# Altium schematic sheet S02.SchDoc: DQLA-Q  Dual QLA Interface Board
size 381 x 254 mm; Revision: 1.1; SheetNumber: 2; SheetTotal: 3
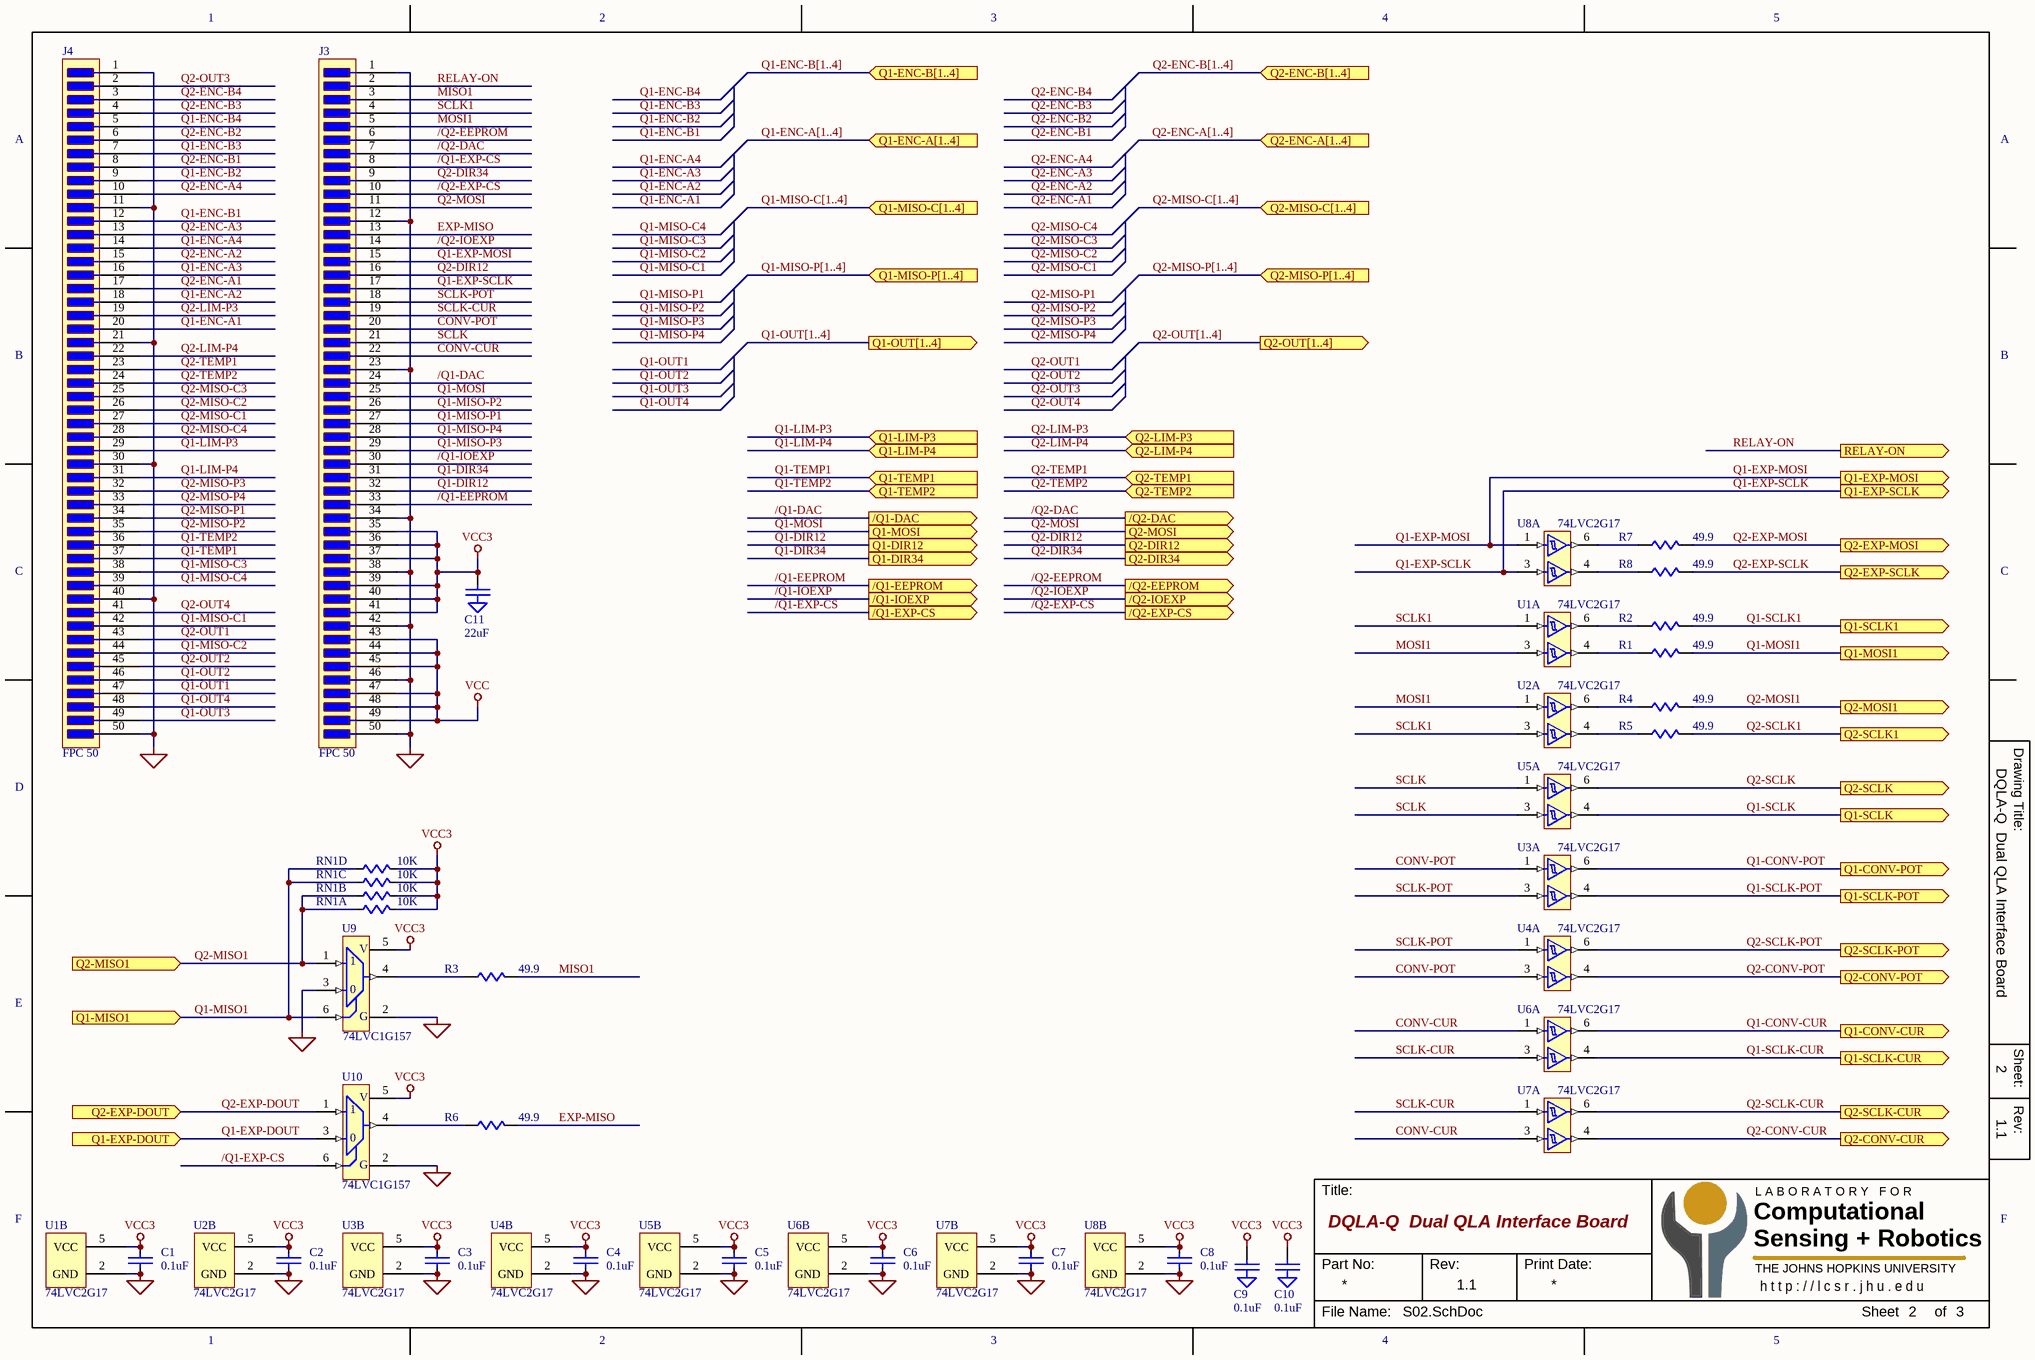
[diagram p0: S02.SchDoc]

## Parts
C1  0.1uF  [C0402]
C2  0.1uF  [C0402]
C3  0.1uF  [C0402]
C4  0.1uF  [C0402]
C5  0.1uF  [C0402]
C6  0.1uF  [C0402]
C7  0.1uF  [C0402]
C8  0.1uF  [C0402]
C9  0.1uF  [C0402]
C10  0.1uF  [C0402]
C11  22uF  [C0805]
J3  FPC 50  [CONN-XF3M1-5015-1B]
J4  FPC 50  [CONN-XF3M1-5015-1B]
R1  49.9  [R0402]
R2  49.9  [R0402]
R3  49.9  [R0402]
R4  49.9  [R0402]
R5  49.9  [R0402]
R6  49.9  [R0402]
R7  49.9  [R0402]
R8  49.9  [R0402]
RN1  10K  [RN-742C083]  (parts A,B,C,D of 4)
U1  74LVC2G17  [SC70-6]  (parts A,B of 2)
U2  74LVC2G17  [SC70-6]  (parts A,B of 2)
U3  74LVC2G17  [SC70-6]  (parts A,B of 2)
U4  74LVC2G17  [SC70-6]  (parts A,B of 2)
U5  74LVC2G17  [SC70-6]  (parts A,B of 2)
U6  74LVC2G17  [SC70-6]  (parts A,B of 2)
U7  74LVC2G17  [SC70-6]  (parts A,B of 2)
U8  74LVC2G17  [SC70-6]  (parts A,B of 2)
U9  74LVC1G157  [SC70-6]
U10  74LVC1G157  [SC70-6]

## Ports
/Q1-DAC (out), /Q1-EEPROM (out), /Q1-EXP-CS (out), /Q1-IOEXP (out), /Q2-DAC (out), /Q2-EEPROM (out), /Q2-EXP-CS (out), /Q2-IOEXP (out), Q1-CONV-CUR (out), Q1-CONV-POT (out), Q1-DIR12 (out), Q1-DIR34 (out), Q1-ENC-A[1..4] (in), Q1-ENC-B[1..4] (in), Q1-EXP-DOUT (in), Q1-EXP-MOSI (out), Q1-EXP-SCLK (out), Q1-LIM-P3 (in), Q1-LIM-P4 (in), Q1-MISO1 (in), Q1-MISO-C[1..4] (in), Q1-MISO-P[1..4] (in), Q1-MOSI1 (out), Q1-MOSI (out), Q1-OUT[1..4] (out), Q1-SCLK1 (out), Q1-SCLK (out), Q1-SCLK-CUR (out), Q1-SCLK-POT (out), Q1-TEMP1 (in), Q1-TEMP2 (in), Q2-CONV-CUR (out), Q2-CONV-POT (out), Q2-DIR12 (out), Q2-DIR34 (out), Q2-ENC-A[1..4] (in), Q2-ENC-B[1..4] (in), Q2-EXP-DOUT (in), Q2-EXP-MOSI (out), Q2-EXP-SCLK (out), Q2-LIM-P3 (in), Q2-LIM-P4 (in), Q2-MISO1 (in), Q2-MISO-C[1..4] (in), Q2-MISO-P[1..4] (in), Q2-MOSI1 (out), Q2-MOSI (out), Q2-OUT[1..4] (out), Q2-SCLK1 (out), Q2-SCLK (out), Q2-SCLK-CUR (out), Q2-SCLK-POT (out), Q2-TEMP1 (in), Q2-TEMP2 (in), RELAY-ON (out)

## Nets
GND: C1.2 C2.2 C3.2 C4.2 C5.2 C6.2 C7.2 C8.2 C9.2(GND) C10.2(GND) C11.2(GND) J3.1 J3.12 J3.23 J3.34 J3.38 J3.42 J3.46 J3.50 J4.1 J4.11 J4.21 J4.30 J4.40 J4.50 U1.2(GND) U2.2(GND) U3.2(GND) U4.2(GND) U5.2(GND) U6.2(GND) U7.2(GND) U8.2(GND) U9.2(-) U9.3 U10.2(-)
VCC: J3.43 J3.44 J3.45 J3.47 J3.48 J3.49
VCC3: C1.1 C2.1 C3.1 C4.1 C5.1 C6.1 C7.1 C8.1 C9.1 C10.1 C11.1 J3.35 J3.36 J3.37 J3.39 J3.40 J3.41 RN1.5 RN1.6 RN1.7 RN1.8 U1.5(VCC) U2.5(VCC) U3.5(VCC) U4.5(VCC) U5.5(VCC) U6.5(VCC) U7.5(VCC) U8.5(VCC) U9.5(+) U10.5(+)
/Q1-DAC: J3.24 ; port /Q1-DAC
/Q1-EEPROM: J3.33 ; port /Q1-EEPROM
/Q1-EXP-CS: J3.8 U10.6 ; port /Q1-EXP-CS
/Q1-IOEXP: J3.30 ; port /Q1-IOEXP
/Q2-DAC: J3.7 ; port /Q2-DAC
/Q2-EEPROM: J3.6 ; port /Q2-EEPROM
/Q2-EXP-CS: J3.10 ; port /Q2-EXP-CS
/Q2-IOEXP: J3.14 ; port /Q2-IOEXP
CONV-CUR: J3.22 U6.1 U7.3
CONV-POT: J3.20 U3.1 U4.3
EXP-MISO: J3.13 R6.2
MISO1: J3.3 R3.2
MOSI1: J3.5 U1.3 U2.1
Q1-CONV-CUR: U6.6 ; port Q1-CONV-CUR
Q1-CONV-POT: U3.6 ; port Q1-CONV-POT
Q1-DIR12: J3.32 ; port Q1-DIR12
Q1-DIR34: J3.31 ; port Q1-DIR34
Q1-ENC-A1: J4.20
Q1-ENC-A2: J4.18
Q1-ENC-A3: J4.16
Q1-ENC-A4: J4.14
Q1-ENC-B1: J4.12
Q1-ENC-B2: J4.9
Q1-ENC-B3: J4.7
Q1-ENC-B4: J4.5
Q1-EXP-DOUT: U10.3 ; port Q1-EXP-DOUT
Q1-EXP-MOSI: J3.15 U8.1 ; port Q1-EXP-MOSI
Q1-EXP-SCLK: J3.17 U8.3 ; port Q1-EXP-SCLK
Q1-LIM-P3: J4.29 ; port Q1-LIM-P3
Q1-LIM-P4: J4.31 ; port Q1-LIM-P4
Q1-MISO1: RN1.3 RN1.4 U9.6 ; port Q1-MISO1
Q1-MISO-C1: J4.42
Q1-MISO-C2: J4.44
Q1-MISO-C3: J4.38
Q1-MISO-C4: J4.39
Q1-MISO-P1: J3.27
Q1-MISO-P2: J3.26
Q1-MISO-P3: J3.29
Q1-MISO-P4: J3.28
Q1-MOSI: J3.25 ; port Q1-MOSI
Q1-MOSI1: R1.2 ; port Q1-MOSI1
Q1-OUT1: J4.47
Q1-OUT2: J4.46
Q1-OUT3: J4.49
Q1-OUT4: J4.48
Q1-SCLK: U5.4 ; port Q1-SCLK
Q1-SCLK1: R2.2 ; port Q1-SCLK1
Q1-SCLK-CUR: U6.4 ; port Q1-SCLK-CUR
Q1-SCLK-POT: U3.4 ; port Q1-SCLK-POT
Q1-TEMP1: J4.37 ; port Q1-TEMP1
Q1-TEMP2: J4.36 ; port Q1-TEMP2
Q2-CONV-CUR: U7.4 ; port Q2-CONV-CUR
Q2-CONV-POT: U4.4 ; port Q2-CONV-POT
Q2-DIR12: J3.16 ; port Q2-DIR12
Q2-DIR34: J3.9 ; port Q2-DIR34
Q2-ENC-A1: J4.17
Q2-ENC-A2: J4.15
Q2-ENC-A3: J4.13
Q2-ENC-A4: J4.10
Q2-ENC-B1: J4.8
Q2-ENC-B2: J4.6
Q2-ENC-B3: J4.4
Q2-ENC-B4: J4.3
Q2-EXP-DOUT: U10.1 ; port Q2-EXP-DOUT
Q2-EXP-MOSI: R7.2 ; port Q2-EXP-MOSI
Q2-EXP-SCLK: R8.2 ; port Q2-EXP-SCLK
Q2-LIM-P3: J4.19 ; port Q2-LIM-P3
Q2-LIM-P4: J4.22 ; port Q2-LIM-P4
Q2-MISO1: RN1.1 RN1.2 U9.1 ; port Q2-MISO1
Q2-MISO-C1: J4.27
Q2-MISO-C2: J4.26
Q2-MISO-C3: J4.25
Q2-MISO-C4: J4.28
Q2-MISO-P1: J4.34
Q2-MISO-P2: J4.35
Q2-MISO-P3: J4.32
Q2-MISO-P4: J4.33
Q2-MOSI: J3.11 ; port Q2-MOSI
Q2-MOSI1: R4.2 ; port Q2-MOSI1
Q2-OUT1: J4.43
Q2-OUT2: J4.45
Q2-OUT3: J4.2
Q2-OUT4: J4.41
Q2-SCLK: U5.6 ; port Q2-SCLK
Q2-SCLK1: R5.2 ; port Q2-SCLK1
Q2-SCLK-CUR: U7.6 ; port Q2-SCLK-CUR
Q2-SCLK-POT: U4.6 ; port Q2-SCLK-POT
Q2-TEMP1: J4.23 ; port Q2-TEMP1
Q2-TEMP2: J4.24 ; port Q2-TEMP2
RELAY-ON: J3.2 ; port RELAY-ON
SCLK: J3.21 U5.1 U5.3
SCLK1: J3.4 U1.1 U2.3
SCLK-CUR: J3.19 U6.3 U7.1
SCLK-POT: J3.18 U3.3 U4.1
NetR1_1: R1.1 U1.4
NetR2_1: R2.1 U1.6
NetR3_1: R3.1 U9.4
NetR4_1: R4.1 U2.6
NetR5_1: R5.1 U2.4
NetR6_1: R6.1 U10.4
NetR7_1: R7.1 U8.6
NetR8_1: R8.1 U8.4

## Buses and harness runs
bus Q1-ENC-A[1..4] = port Q1-ENC-A[1..4]
bus Q1-ENC-B[1..4] = port Q1-ENC-B[1..4]
bus Q1-MISO-C[1..4] = port Q1-MISO-C[1..4]
bus Q1-MISO-P[1..4] = port Q1-MISO-P[1..4]
bus Q1-OUT[1..4] = port Q1-OUT[1..4]
bus Q2-ENC-A[1..4] = port Q2-ENC-A[1..4]
bus Q2-ENC-B[1..4] = port Q2-ENC-B[1..4]
bus Q2-MISO-C[1..4] = port Q2-MISO-C[1..4]
bus Q2-MISO-P[1..4] = port Q2-MISO-P[1..4]
bus Q2-OUT[1..4] = port Q2-OUT[1..4]

## Notes on the sheet
- 1
- 2
- 3
- 4
- 5
- A
- B
- C
- Drawing Title:
- D
- E
- Sheet:
- Rev:
- F
- Title:
- Computational
- Sensing + Robotics
- L A B O R A T O R Y   F O R
- Part No:
- Print Date:
- THE JOHNS HOPKINS UNIVERSITY
- h t t p : / / l c s r . j h u . e d u
- File Name:
- Sheet
- of
- (in symbol 1G157) V; 0; G

## Library data of the parts
C1-C8 = CAP
C9-C11 = CAP-GND
R1-R8 = R
RN1 = RN-DISC-SM-4X
U1-U8 = 2G17-2: NC7WZ17
U9 U10 = 1G157